# Altium project PRJ_0110_AA.PrjPCB
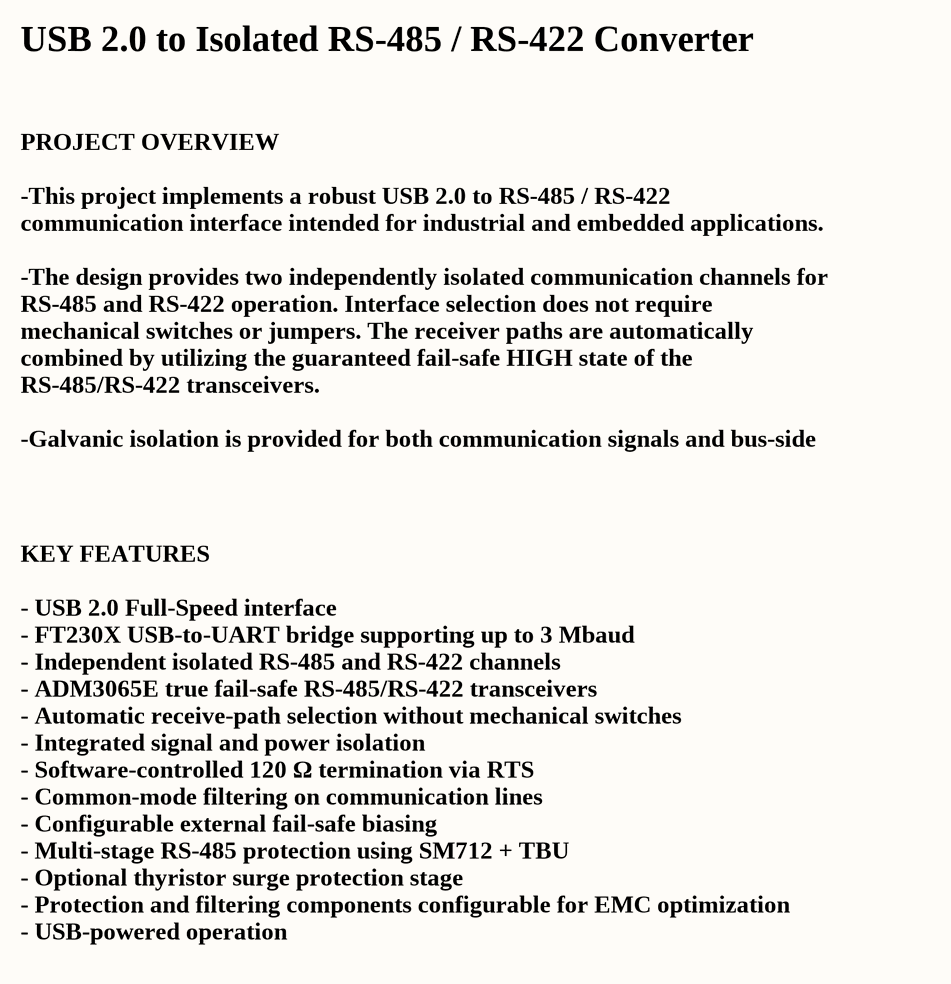
[diagram p0: Header.SchDoc]
pReleaseDate: 09/2026; pProjectName: USB to RS485_RS422 Converter; pProjectCode: PRJ_01101; pPreparedBy: Cemil Kendir; pPBARevision: AA; pPBADescription: USB to RS485_RS422 Converter; pPBACode: 01; pModifiedDate: -; pModifiedBy: -; pDrawnBy: Cemil Kendir; pDocumentNumber: PRJ_01101; pDesignEnvironment: Altium Designer 23.9.2; pDesignedBy: Cemil Kendir; pCheckedBy: Cemre Kendir; pApprovedBy: Suheyla Inal KENDİR; FO_CheckedBy: Gunes Kendir; FO_ApprovedBy: Cemre Kendir; DocumentName: ASSEMBLY DOCUMENT
5 sheets, 107 parts. Net scope: hierarchical (ports join the sheet entries above them; power ports are global).
Board file: PRJ_0110_AAAA.PcbDoc
Sheets:
  Header.SchDoc
  Main.SchDoc
    USB To UART = UsbToUart.SchDoc
    RS485 = RS485.SchDoc
    CH_1 = Isolator.SchDoc
    RS422 = RS485.SchDoc
    CH_2 = Isolator.SchDoc

## Sheet Header.SchDoc
size A4 portrait; DocumentNumber: 1; SheetNumber: 1; SheetTotal: 5

### Notes on the sheet
- USB 2.0 to Isolated RS-485 / RS-422 Converter
- PROJECT OVERVIEW
  -This project implements a robust USB 2.0 to RS-485 / RS-422 communication interface intended for industrial and embedded applications.
  -The design provides two independently isolated communication channels for RS-485 and RS-422 operation. Interface selection does not require mechanical switches or jumpers. The receiver paths are automatically combined by utilizing the guaranteed fail-safe HIGH state of the RS-485/RS-422 transceivers.
  -Galvanic isolation is provided for both communication signals and bus-side power. The RS-485 interface includes software-controlled 120 Ω termination and a configurable multi-stage protection network designed to improve immunity against ESD, surge and other bus transients.
- KEY FEATURES
  - USB 2.0 Full-Speed interface
  - FT230X USB-to-UART bridge supporting up to 3 Mbaud
  - Independent isolated RS-485 and RS-422 channels
  - ADM3065E true fail-safe RS-485/RS-422 transceivers
  - Automatic receive-path selection without mechanical switches
  - Integrated signal and power isolation
  - Software-controlled 120 Ω termination via RTS
  - Common-mode filtering on communication lines
  - Configurable external fail-safe biasing
  - Multi-stage RS-485 protection using SM712 + TBU
  - Optional thyristor surge protection stage
  - Protection and filtering components configurable for EMC optimization
  - USB-powered operation
- Tarih/Date
- Tasa/Desig
- Kont/Check
- Onay/Appr
- Sayfa/Sht
- Form
- Ortam/Env
- A4
- /
- Deg Tarihi/Chng Date
- Deg Onay/Chng Appr
- Rev
- (c) 2022 by SCSG Elektronik A.Ş.
  All rights Reserved. No part of this document may be produced or transmitted in any form or by any means electronic, mechanical, photocopying, recording, or otherwise, without prior written permission of SCSG.

## Sheet Main.SchDoc
size A4; DocumentNumber: 1; SheetNumber: 2; SheetTotal: 5
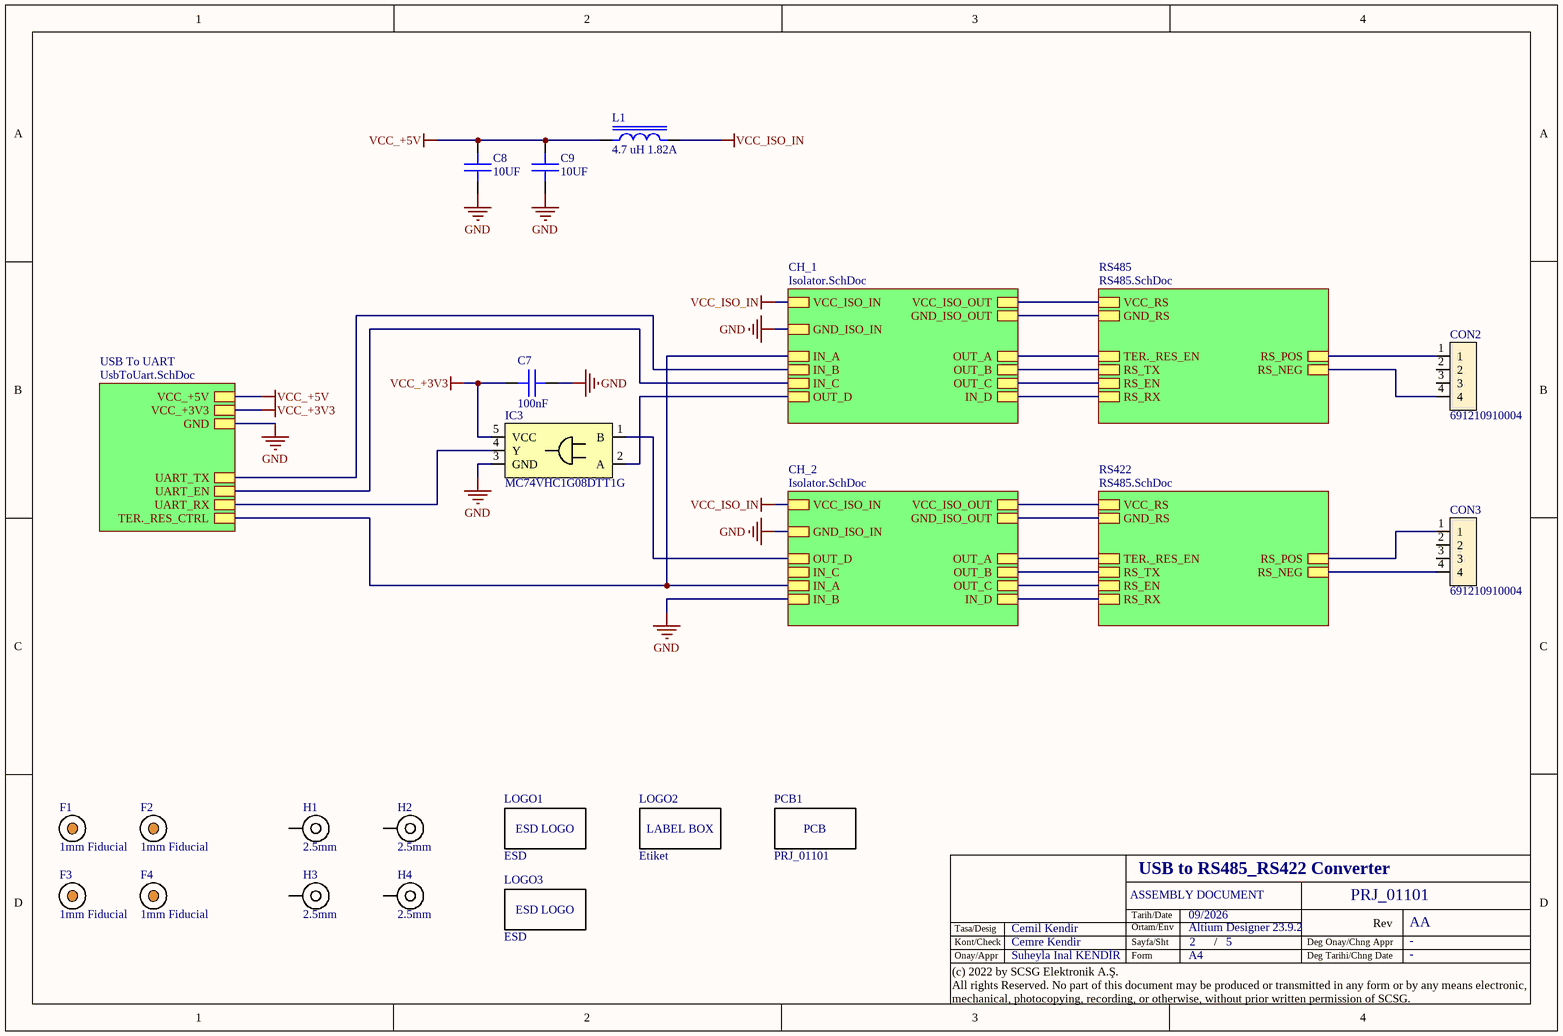
[diagram p1: Main.SchDoc]

### Parts
C7  100nF  [C0603]
C8  10UF  [c1206]
C9  10UF  [c1206]
CON2  691210910004  [691210910004]
CON3  691210910004  [691210910004]
F1  1mm Fiducial  [1mm Fiducial]  (no BOM)
F2  1mm Fiducial  [1mm Fiducial]  (no BOM)
F3  1mm Fiducial  [1mm Fiducial]  (no BOM)
F4  1mm Fiducial  [1mm Fiducial]  (no BOM)
H1  2.5mm  [2.5mm hole]  (no BOM)
H2  2.5mm  [2.5mm hole]  (no BOM)
H3  2.5mm  [2.5mm hole]  (no BOM)
H4  2.5mm  [2.5mm hole]  (no BOM)
IC3  MC74VHC1G08DTT1G  [SOT23-5]
L1  4.7 uH 1.82A  [WE-PD2_4532]
LOGO1  ESD  [ESD]  (no BOM)
LOGO2  Etiket  [ETIKET]  (no BOM)
LOGO3  ESD  [ESD]  (no BOM)
PCB1  PRJ_01101  [PCB]

### Sub-sheets
CH_1 = Isolator.SchDoc: IN_A, IN_B, IN_C, OUT_D, OUT_A, OUT_B, OUT_C, IN_D, VCC_ISO_IN, GND_ISO_IN, VCC_ISO_OUT, GND_ISO_OUT
CH_2 = Isolator.SchDoc: IN_A, IN_B, IN_C, OUT_D, OUT_A, OUT_B, OUT_C, IN_D, VCC_ISO_IN, GND_ISO_IN, VCC_ISO_OUT, GND_ISO_OUT
RS422 = RS485.SchDoc: RS_RX, RS_TX, RS_EN, RS_POS, RS_NEG, GND_RS, VCC_RS, TER._RES_EN
RS485 = RS485.SchDoc: RS_RX, RS_TX, RS_EN, RS_POS, RS_NEG, GND_RS, VCC_RS, TER._RES_EN
USB To UART = UsbToUart.SchDoc: UART_RX, UART_TX, UART_EN, VCC_+3V3, GND, VCC_+5V, TER._RES_CTRL

### Nets
GND: C7.1 C8.1 C9.1 IC3.3(GND) ; sheet USB To UART/GND, sheet CH_1/GND_ISO_IN, sheet CH_2/IN_B, sheet CH_2/GND_ISO_IN
GND_ISO: sheet RS485/GND_RS, sheet CH_1/GND_ISO_OUT, sheet RS422/GND_RS, sheet CH_2/GND_ISO_OUT
VCC_+3V3: C7.2 IC3.5(VCC) ; sheet USB To UART/VCC_+3V3  [project net +3V3]
VCC_+5V: C8.2 C9.2 L1.1 ; sheet USB To UART/VCC_+5V  [project net +5V]
VCC_ISO: sheet RS485/VCC_RS, sheet CH_1/VCC_ISO_OUT, sheet RS422/VCC_RS, sheet CH_2/VCC_ISO_OUT
VCC_ISO_IN: L1.2 ; sheet CH_1/VCC_ISO_IN, sheet CH_2/VCC_ISO_IN  [project net VCC]
___RS485_N: CON2.4 ; sheet RS485/RS_NEG
___RS485_N: CON3.4 ; sheet RS422/RS_NEG  [a separate net that carries the same name]
___RS485_P: CON2.1 ; sheet RS485/RS_POS
___RS485_P: CON3.1 ; sheet RS422/RS_POS  [a separate net that carries the same name]
RS485_EN_ISO: sheet RS485/RS_EN, sheet CH_1/OUT_C
RS485_EN_ISO: sheet RS422/RS_EN, sheet CH_2/OUT_C  [a separate net that carries the same name]
RS485_RX_ISO: sheet RS485/RS_RX, sheet CH_1/IN_D
RS485_RX_ISO: sheet RS422/RS_RX, sheet CH_2/IN_D  [a separate net that carries the same name]
RS485_TX_ISO: sheet RS485/RS_TX, sheet CH_1/OUT_B
RS485_TX_ISO: sheet RS422/RS_TX, sheet CH_2/OUT_B  [a separate net that carries the same name]
TER._RES_CTRL: sheet USB To UART/TER._RES_CTRL, sheet CH_1/IN_A, sheet CH_2/IN_A
UART_EN: sheet USB To UART/UART_EN, sheet CH_1/IN_C
UART_RX: IC3.4(Y) ; sheet USB To UART/UART_RX
UART_TX: sheet USB To UART/UART_TX, sheet CH_1/IN_B
NetIC3_1: IC3.1(B) ; sheet CH_2/OUT_D
NetIC3_2: IC3.2(A) ; sheet CH_1/OUT_D
NetIC4_CH_1_14: sheet RS485/TER._RES_EN, sheet CH_1/OUT_A
NetIC4_CH_2_14: sheet RS422/TER._RES_EN, sheet CH_2/OUT_A

Not connected (* = marked no-connect by the designer): CON2 2 3; CON3 2 3; H1 1; H2 1; H3 1; H4 1

### Notes on the sheet
- Tarih/Date
- Tasa/Desig
- Kont/Check
- Onay/Appr
- Sayfa/Sht
- Form
- Ortam/Env
- A4
- /
- Deg Tarihi/Chng Date
- Deg Onay/Chng Appr
- Rev
- (c) 2022 by SCSG Elektronik A.Ş.
  All rights Reserved. No part of this document may be produced or transmitted in any form or by any means electronic, mechanical, photocopying, recording, or otherwise, without prior written permission of SCSG.
- (in symbol Etiket) LABEL BOX

### Library data of the parts
C7 = CC0603KRX7R8BB104: 100nF, 25V, X7R, 0603; Manufacturer: Yageo; Value: 100000; Tolerance: 10%; Dielectric Material: Ceramic; Purpose Of Usage: BASIC; Working Voltage: 0; Supplier 1: Digi-Key; Supplier Part Number 1: 311-1341-1-ND; Manufacturer Part Number: CC0603KRX7R8BB104; RoHS: YES; Mount: SMD; Case/Package: 0603; Case Code (Imperial): 0603; Case Code (Metric): 1608; Min Operating Temperature: -55°C; Max Operating Temperature: 125°C; Voltage Rating: 25V; Voltage Rating (DC): 25V; Dielectric: X7R; Height: 0.8mm; Category: CAPASITOR; Sub-Category: CERAMIC; Stock ID: ??; Local Supplier: GENERAL; Price 10K: 0.00250
C8 C9 = CL31B106MOHNNNE: 10UF, 16V, X7R, 1206; Manufacturer: Samsung; Value: 10000000; Tolerance: 20%; Dielectric Material: Ceramic; Purpose Of Usage: BASIC; Working Voltage: 0; Supplier 1: Digi-Key; Supplier Part Number 1: 1276-6641-1-ND; Manufacturer Part Number: CL31B106MOHNNNE; RoHS: YES; Mount: SMD; Case/Package: 1206; Case Code (Metric): 3216; Case Code (Imperial): 1206; Min Operating Temperature: -55°C; Max Operating Temperature: 125°C; Dielectric: X7R; Voltage Rating (DC): 16V; Voltage Rating: 16V; Category: CAPASITOR; Sub-Category: CERAMIC; Stock ID: ??; Local Supplier: GENERAL; Price 10K: 0.00250
CON2 CON3 = 691210910004: WR-TBL Terminal block - Rising Cage - THT; Manufacturer: Wurth Elektronik; Current Rating: 6A; Pitch: 2.54mm; Gender: Male; Number of Contacts: 4; Purpose Of Usage: BASIC; Manufacturer Part Number: 691210910004; RoHS: Compliant; Category: CONNECTORS; Length: 10.56mm; Max Operating Temperature: 105°C; Min Operating Temperature: -40°C; Color: Green; Local Supplier: WURTH; Mount: SMD; Stock ID: ??; Sub-Category: TERMINAL BLOCK; Supplier 1: Digi-Key; Supplier Part Number 1: 732-691210910004-ND
F1-F4 = 1mm Fiducial: Manufacturer Part Number: Fiducial 2mm; Purpose Of Usage: BASIC; Category: MECHANICAL; Sub-Category: FIDUCIAL; Manufacturer: --; Mount: NO MOUNT; Stock ID: ??
H1-H4 = 2.5 mm Hole: 2.5mm hole; Purpose Of Usage: BASIC; Category: MECHANICAL; Sub-Category: HOLE; Manufacturer: --; Manufacturer Part Number: --; Mount: NO MOUNT; Stock ID: ??
IC3 = MC74VHC1G08DTT1G: MC74VHC1G08 Series 2 to 5.5 SMT Single 2 Input AND Gate - SOT-23-5; Manufacturer: ON Semiconductor; Max Supply Voltage: 5.5V; Min Supply Voltage: 2V; Purpose Of Usage: BASIC; Manufacturer Part Number: MC74VHC1G08DTT1G; RoHS: YES; Category: INTEGRATED CIRCUITS; Case/Package: SOT-23-5; Min Operating Temperature: -55°C; Max Operating Temperature: 125°C; Package Quantity: 1; Lead Free: Lead Free; Supplier 1: Digi-Key; Supplier Part Number 1: MC74VHC1G08DTT1GOSTR-ND; Mount: SMD; MSL: 1; Stock ID: ??; Sub-Category: LOGIC
L1 = 744773047: WE-PD2, Unshielded Wire-wound SMD Inductor With Ferrite Core, 4.7 Uh, 1.82A I; Manufacturer: Wurth Elektronik; DC Resistance (DCR): 59mΩ; Value: 4.7µH; Inductance Tolerance: 20%; Saturation Current: 2.9A; Self Resonant Frequency: 45MHz; Test Frequency: 10kHz; Manufacturer Part Number: 744773047; RoHS: YES; Category: INDUCTORS; Case/Package: SMD/SMT; Current Rating: 1.82A; Height: 3.2mm; Length: 4mm; Max DC Current: 1.82A; Max Operating Temperature: 125°C; Min Operating Temperature: -40°C; RMS Current (Irms): 1.82A; Shielding: Unshielded; Mount: SMD; Stock ID: ??; Sub-Category: FIXED INDUCTORS; Supplier 1: Digi-Key; Supplier Part Number 1: 732-1252-1-ND
LOGO1 LOGO3 = ESD: ESD LOGO; Purpose Of Usage: BASIC; Category: MECHANICAL; Sub-Category: LOGO; Manufacturer: --; Manufacturer Part Number: ESD; Mount: NO MOUNT; Stock ID: ??
LOGO2 = Etiket: Etiket kutu; Purpose Of Usage: BASIC; Category: MECHANICAL; Sub-Category: LOGO; Manufacturer: --; Manufacturer Part Number: Etiket; Mount: NO MOUNT; Stock ID: ??
PCB1 = PCB: Manufacturer: CUSTOM; Purpose Of Usage: BASIC; Category: MECHANICAL; Local Supplier: CUSTOM; Manufacturer Part Number: CUSTOM; Mount: MECH; Price 10K: 0.25; Stock ID: ??; Sub-Category: PCB; Supplier 1: CUSTOM; Supplier Part Number 1: CUSTOM

## Sheet UsbToUart.SchDoc
size A4 portrait; Address1: 00-<Schema Name>; DocumentNumber: 1; SheetNumber: 3; SheetTotal: 5; ModifiedBy: -; RevisionDate: -; Size: A3
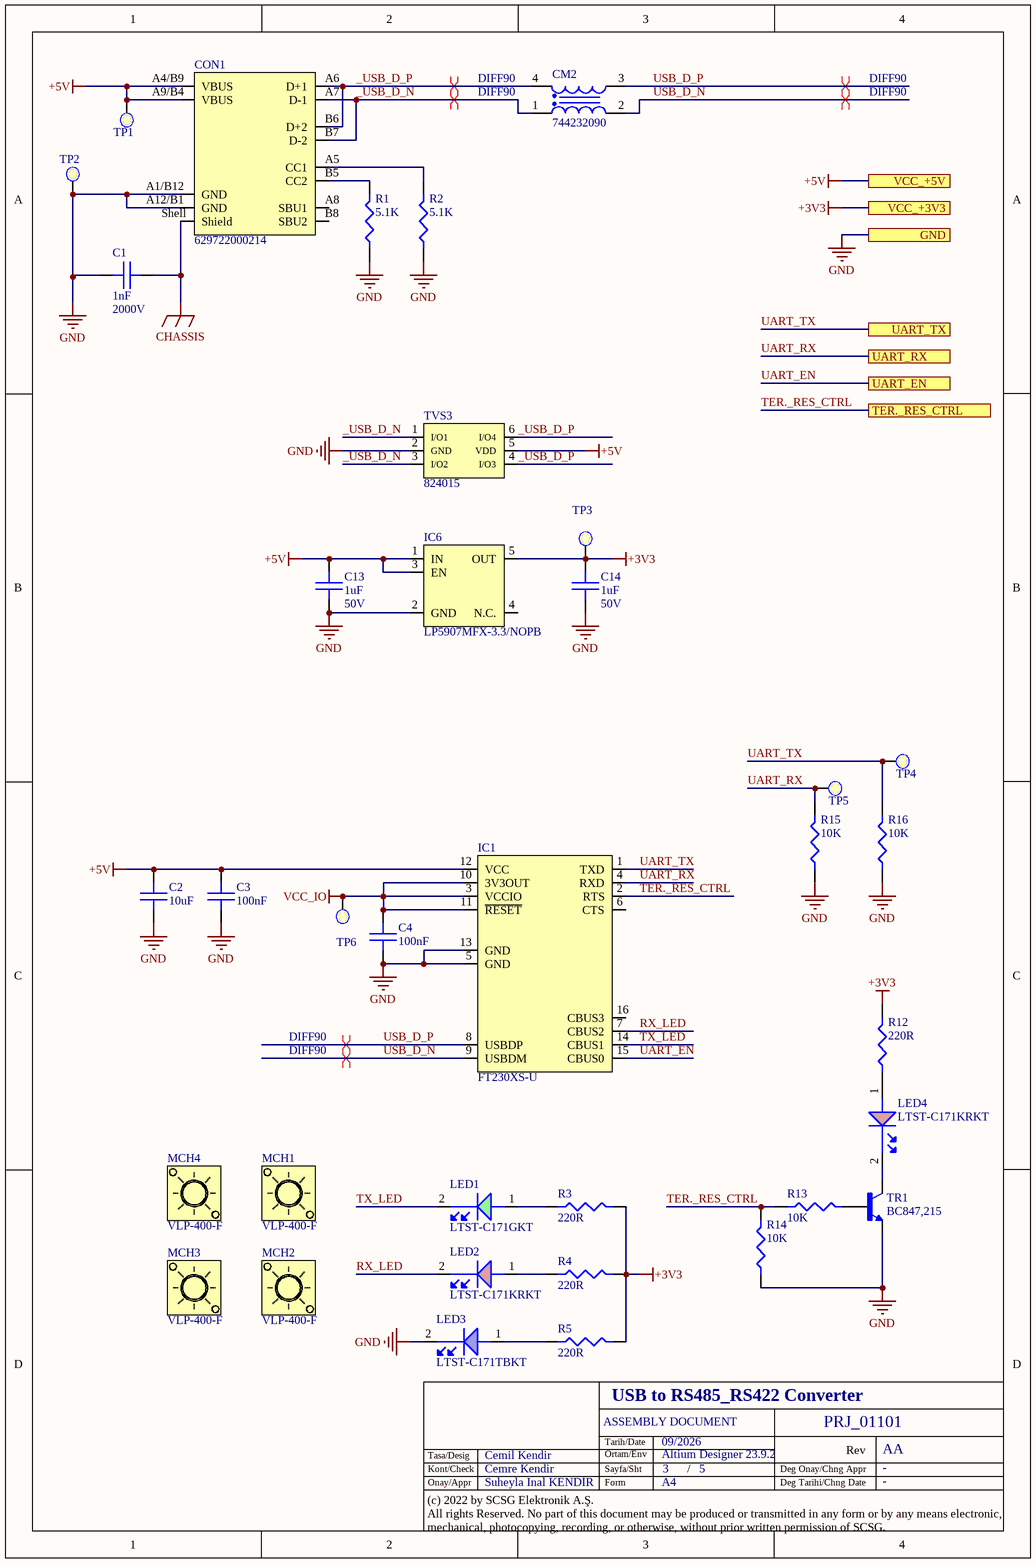
[diagram p2: UsbToUart.SchDoc]

### Parts
C1  1nF  Voltage Rating: 2000V  [C1206]
C2  10uF  [C0805]
C3  100nF  [C0603]
C4  100nF  [C0603]
C13  1uF  Voltage Rating: 50V  [C0603]
C14  1uF  Voltage Rating: 50V  [C0603]
CM2  744232090  [WE-CNSW_1206]
CON1  629722000214  [629722000214]
IC1  FT230XS-U  [SSOP-16]
IC6  LP5907MFX-3.3/NOPB  [SOT23-5]
LED1  LTST-C171GKT  [0805_green]
LED2  LTST-C171KRKT  [0805_RED]
LED3  LTST-C171TBKT  [0805_blue]
LED4  LTST-C171KRKT  [0805_RED]
MCH1  VLP-400-F  [VLP-400-F]
MCH2  VLP-400-F  [VLP-400-F]
MCH3  VLP-400-F  [VLP-400-F]
MCH4  VLP-400-F  [VLP-400-F]
R1  5.1K  [R0402]
R2  5.1K  [R0402]
R3  220R  [R0603]
R4  220R  [R0603]
R5  220R  [R0603]
R12  220R  [R0603]
R13  10K  [R0603]
R14  10K  [R0603]
R15  10K  [R0603]
R16  10K  [R0603]
TP1  TestPoint1  [SMD_1mmPoint]  (value not drawn)  (no BOM)
TP2  TestPoint1  [SMD_1mmPoint]  (value not drawn)  (no BOM)
TP3  TestPoint1  [SMD_1mmPoint]  (value not drawn)  (no BOM)
TP4  TestPoint1  [SMD_1mmPoint]  (value not drawn)  (no BOM)
TP5  TestPoint1  [SMD_1mmPoint]  (value not drawn)  (no BOM)
TP6  TestPoint1  [SMD_1mmPoint]  (value not drawn)  (no BOM)
TR1  BC847,215  [SOT23-3]
TVS3  824015  [SOT-23-6]

### Ports
GND, TER._RES_CTRL, UART_EN, UART_RX, UART_TX, VCC_+3V3, VCC_+5V

### Nets
+3V3: C14.2 IC6.5(OUT) R3.2 R4.2 R5.2 R12.2 TP3.1 ; port VCC_+3V3
+5V: C2.2 C3.2 C13.2 CON1.A4/B9(VBUS) CON1.A9/B4(VBUS) IC1.12(VCC) IC6.1(IN) IC6.3(EN) TP1.1 TVS3.5(VDD) ; port VCC_+5V
CHASSIS: C1.2 CON1.Shell(Shield)
GND: C1.1 C2.1 C3.1 C4.1 C13.1 C14.1 CON1.A1/B12(GND) CON1.A12/B1(GND) IC1.5(GND) IC1.13(GND) IC6.2(GND) LED3.2 R1.1 R2.1 R14.1 R15.1 R16.1 TP2.1 TR1.2(E) TVS3.2(GND) ; port GND
VCC_IO: C4.2 IC1.3(VCCIO) IC1.10(3V3OUT) IC1.11(~{RESET}) TP6.1
_USB_D_N: CM2.1 CON1.A7(D-1) CON1.B7(D-2) TVS3.1(I/O1) TVS3.3(I/O2)
_USB_D_P: CM2.4 CON1.A6(D+1) CON1.B6(D+2) TVS3.4(I/O3) TVS3.6(I/O4)
RX_LED: IC1.7(CBUS2) LED2.2
TER._RES_CTRL: IC1.2(RTS) R13.1 R14.2 ; port TER._RES_CTRL
TX_LED: IC1.14(CBUS1) LED1.2
UART_EN: IC1.15(CBUS0) ; port UART_EN
UART_RX: IC1.4(RXD) R15.2 TP5.1 ; port UART_RX
UART_TX: IC1.1(TXD) R16.2 TP4.1 ; port UART_TX
USB_D_N: CM2.2 IC1.9(USBDM)
USB_D_P: CM2.3 IC1.8(USBDP)
NetCON1_A5: CON1.A5(CC1) R2.2
NetCON1_B5: CON1.B5(CC2) R1.2
NetLED1_1: LED1.1 R3.1
NetLED2_1: LED2.1 R4.1
NetLED3_1: LED3.1 R5.1
NetLED4_1: LED4.1 R12.1
NetLED4_2: LED4.2 TR1.3(C)
NetR13_2: R13.2 TR1.1(B)

Not connected (* = marked no-connect by the designer): CON1 A8(SBU1) B8(SBU2); IC1 6(CTS) 16(CBUS3); IC6 4(N.C.)

### Layout directives
differential pair; net class DIFF90: _USB_D_N, _USB_D_P, USB_D_N, USB_D_P

### Notes on the sheet
- Tarih/Date
- Tasa/Desig
- Kont/Check
- Onay/Appr
- Sayfa/Sht
- Form
- Ortam/Env
- A4
- /
- Deg Tarihi/Chng Date
- Deg Onay/Chng Appr
- Rev
- (c) 2022 by SCSG Elektronik A.Ş.
  All rights Reserved. No part of this document may be produced or transmitted in any form or by any means electronic, mechanical, photocopying, recording, or otherwise, without prior written permission of SCSG.

### Library data of the parts
C1 = CS1206KKX7RDBB102: 1nF, 2kV, X7R, 1206; Manufacturer: Yageo; Dielectric Material: Ceramic; Purpose Of Usage: USB_to_UART; Tolerance: 10%; Value: 1000; Working Voltage: 0; Manufacturer Part Number: CS1206KKX7RDBB102; RoHS: YES; Category: CAPASITOR; Case/Package: 1206; Case Code (Imperial): 1206; Case Code (Metric): 3216; Dielectric: X7R; Height: 1.45mm; Local Supplier: GENERAL; Max Operating Temperature: 125°C; Min Operating Temperature: -55°C; Mount: SMD; Price 10K: 0.5; Stock ID: ??; Sub-Category: CERAMIC; Supplier 1: Digi-Key; Supplier Part Number 1: 13-CS1206KKX7RDBB102TR-ND; Voltage Rating (DC): 2000V
C2 = CC0805KFX7R6BB106: 10uF ,10V ,X7R ,0805; Manufacturer: Yageo; Value: 10000000; Dielectric Material: Ceramic; Tolerance: 10%; Purpose Of Usage: USB_to_UART; Working Voltage: 0; Supplier 1: Digi-Key; Manufacturer Part Number: CC0805KFX7R6BB106; RoHS: YES; Supplier Part Number 1: 13-CC0805KFX7R6BB106CT-ND; Category: CAPASITOR; Sub-Category: CERAMIC; Case/Package: 0805; Case Code (Imperial): 0805; Case Code (Metric): 2012; Dielectric: X7R; Max Operating Temperature: 125°C; Min Operating Temperature: -55°C; Mount: SMD; Stock ID: ??; Voltage Rating (DC): 10V; Voltage Rating: 10V; Local Supplier: GENERAL; Price 10K: 0.00250
C3 C4 = CC0603KRX7R8BB104: 100nF, 25V, X7R, 0603; Manufacturer: Yageo; Value: 100000; Tolerance: 10%; Dielectric Material: Ceramic; Purpose Of Usage: USB_to_UART; Working Voltage: 0; Supplier 1: Digi-Key; Supplier Part Number 1: 311-1341-1-ND; Manufacturer Part Number: CC0603KRX7R8BB104; RoHS: YES; Mount: SMD; Case/Package: 0603; Case Code (Imperial): 0603; Case Code (Metric): 1608; Min Operating Temperature: -55°C; Max Operating Temperature: 125°C; Voltage Rating: 25V; Voltage Rating (DC): 25V; Dielectric: X7R; Height: 0.8mm; Category: CAPASITOR; Sub-Category: CERAMIC; Stock ID: ??; Local Supplier: GENERAL; Price 10K: 0.00250
C13 C14 = CC0603KRX7R9BB105: 1uF, 50V, X7R, 0603; Manufacturer: Yageo; Value: 1000000; Tolerance: 10%; Dielectric Material: Ceramic; Purpose Of Usage: USB_to_UART; Working Voltage: 0; Manufacturer Part Number: CC0603KRX7R9BB105; RoHS: YES; Category: CAPASITOR; Case/Package: 0603; Case Code (Metric): 1608; Case Code (Imperial): 0603; Min Operating Temperature: -55°C; Max Operating Temperature: 125°C; Dielectric: X7R; Voltage Rating (DC): 50V; Height: 0.95mm; Local Supplier: GENERAL; Mount: SMD; MSL: 1; Price 10K: 0.00250; Stock ID: ??; Sub-Category: CERAMIC; Supplier 1: Digi-Key; Supplier Part Number 1: 311-2082-2-ND
CM2 = 744232090: Common Mode Chokes Dual 90Ohm 100MHz 370mA SMD T/R; Manufacturer: Wurth Electronics; Value: 3.3H; DC Resistance (DCR): 300mR; Inductance Tolerance: 25%; Purpose Of Usage: USB_to_UART; Supplier 1: Digi-Key; Supplier Part Number 1: 732-1469-1-ND; Manufacturer Part Number: 744232090; RoHS: YES; Mount: SMD; Case/Package: SMD/SMT; Min Operating Temperature: -40°C; Max Operating Temperature: 125°C; Current Rating: 370mA; Length: 3.2mm; Category: INDUCTORS; Sub-Category: COMMON MODE CHOKES; Stock ID: ??
CON1 = 629722000214: Wr-com_usb 2.0_TYPE C_horizontal; Manufacturer: Wurth Elektronik; Gender: Receptacle; Number of Contacts: 16; Purpose Of Usage: USB_to_UART; Manufacturer Part Number: 629722000214; Category: CONNECTORS; Local Supplier: WURTH; Max Operating Temperature: 85°C; Min Operating Temperature: -40°C; Mount: SMD; Orientation: Right Angle; RoHS: Yes; Stock ID: ??; Sub-Category: USB Type-C; Supplier 1: Digi-Key; Supplier Part Number 1: 732-629722000214TR-ND
IC1 = FT230XS-U: USB Interface IC USB to Basic Serial UART IC SSOP-16; Manufacturer: FTDI; Purpose Of Usage: USB_to_UART; Supplier 1: Digi-Key; Manufacturer Part Number: FT230XS-U; Stock 1: 4799; RoHS: YES; Case/Package: SSOP; Package Quantity: 100; Lead Free: Lead Free; Category: INTEGRATED CIRCUITS; Supplier Part Number 1: 768-1154-5-ND; Sub-Category: USB to UART; Mount: SMD; Stock ID: ??
IC6 = LP5907MFX-3.3/NOPB: Linear Voltage Regulator IC Positive Fixed 1 Output 250mA SOT-23-5; Manufacturer: TEXAS; Purpose Of Usage: USB_to_UART; Topology: LDO; Max Supply Voltage: 5.5V; Min Supply Voltage: 3.6V; Supplier 1: Digi-Key; Manufacturer Part Number: LP5907MFX-3.3/NOPB; Stock 1: 5836; RoHS: YES; Mount: SMD; Case/Package: SOT-23-5; Package Quantity: 3000; Lead Free: Lead Free; Category: INTEGRATED CIRCUITS; Sub-Category: PMIC - LINEAR REGULATOR; Supplier Part Number 1: 296-38557-2-ND; Stock ID: ??; Max Operating Temperature: +125; Min Operating Temperature: -40; MSL: 1
LED1 = LTST-C171GKT: LED GREEN CLEAR CHIP SMD; Manufacturer: Vishay Lite-On; Purpose Of Usage: USB_to_UART; Supplier 1: Digi-Key; Supplier Part Number: 160-1423-1-ND; Manufacturer Part Number: LTST-C171GKT; RoHS: YES; Mount: SMD; Case/Package: 0805; Color: Green; Min Operating Temperature: -55°C; Max Operating Temperature: 85°C; Category: DIODE; Sub-Category: LED; Stock ID: ??; Supplier Part Number 1: 160-1423-1-ND
LED2 LED4 = LTST-C171KRKT: LED RED CLEAR SMD; Manufacturer: Vishay Lite-On; Purpose Of Usage: USB_to_UART; Supplier 1: Digi-Key; Supplier Part Number 1: 160-1427-1-ND; Manufacturer Part Number: LTST-C171KRKT; RoHS: YES; Mount: SMD; Case/Package: 0805; Color: Red; Min Operating Temperature: -55°C; Max Operating Temperature: 85°C; Category: DIODE; Sub-Category: LED; Stock ID: ??
LED3 = LTST-C171TBKT: LED BLUE CLEAR CHIP SMD; Manufacturer: Vishay Lite-On; Purpose Of Usage: USB_to_UART; Supplier 1: Digi-Key; Supplier Part Number 1: 160-1645-1-ND; Manufacturer Part Number: LTST-C171TBKT; RoHS: YES; Mount: SMD; Case/Package: 0805; Color: Blue; Min Operating Temperature: -20°C; Max Operating Temperature: 80°C; Category: DIODE; Sub-Category: LED; Stock ID: ??
MCH1-MCH4 = VLP-400-F: Bivar straight light guide, rigidity, PCBinstall, 4.1 x 4.1 x 10.2mm; Element Configuration: Single; Purpose Of Usage: USB_to_UART; Manufacturer: Bivar; Manufacturer Part Number: VLP-400-F; RoHS: YES; Category: MECHANICAL; Length: 10.16mm; Material: PC, Polycarbonate; Mounting Technology: PCB; Local Supplier: Bivar; Mount: MECH; Stock ID: ??; Sub-Category: LED PIPE; Supplier 1: Digi-Key; Supplier Part Number 1: 492-1516-ND
R1 R2 = RC0402FR-075K1L: 5.1K, %1, 1/16W, 0402; Manufacturer: YAGEO; Max Power Dissipation: 63mW; Power Rating: 62.5mW; Value: 5100; Temperature Coefficient: 100ppm/°C; Tolerance: 1%; Voltage Rating: 50V; Purpose Of Usage: USB_to_UART; Manufacturer Part Number: RC0402FR-075K1L; RoHS: Compliant; Category: RESISTOR; Case/Package: 0402; Case Code (Imperial): 0402; Max Operating Temperature: 155°C; Min Operating Temperature: -55°C; Voltage Rating (DC): 50V; Working Voltage: 50V; Local Supplier: GENERAL; Mount: SMD; Price 10K: 0.0025; Stock ID: ??; Sub-Category: CHIP RESISTOR; Supplier 1: Digi-Key; Supplier Part Number 1: 311-5.10KLRTR-ND
R3-R5 R12 = RC0603FR-07220RL: 220R, %1, 1/10W, 0603; Manufacturer: YAGEO; Value: 220; Tolerance: 1%; Voltage Rating (DC): 50V; Temperature Coefficient: 100ppm/°C; Power Rating: 100mW; Purpose Of Usage: USB_to_UART; Supplier 1: Digi-Key; Supplier Part Number 1: 311-220HRCT-ND; Manufacturer Part Number: RC0603FR-07220RL; RoHS: YES; Case/Package: 0603; Case Code (Imperial): 0603; Min Operating Temperature: -55°C; Max Operating Temperature: 155°C; Voltage Rating: 50V; Max Power Dissipation: 100mW; Category: RESISTOR; Sub-Category: CHIP RESISTOR; Stock ID: ??; Mount: SMD; Price 10K: 0.0025; Local Supplier: GENERAL
R13-R16 = RT0603FRE0710KL: 10K, %1, 1/10W, 0603; Manufacturer: YAGEO; Value: 10000; Tolerance: 1%; Power Rating: 100mW; Voltage Rating: 75V; Temperature Coefficient: 50ppm/°C; Purpose Of Usage: USB_to_UART; Supplier 1: Digi-Key; Supplier Part Number 1: YAG2321CT-ND; Manufacturer Part Number: RT0603FRE0710KL; RoHS: YES; Case/Package: 0603; Case Code (Imperial): 0603; Min Operating Temperature: -55°C; Max Operating Temperature: 125°C; Max Power Dissipation: 100mW; Voltage Rating (DC): 75V; Category: RESISTOR; Supplier 2: JLCPCB; Supplier Part Number 2: C25804; Sub-Category: CHIP RESISTOR; Stock ID: ??; Mount: SMD; Price 10K: 0.0025; Local Supplier: GENERAL
TP1-TP6 = TestPoint1: test ölçüm noktası; Manufacturer: NO BOM DEVICE; Purpose Of Usage: USB_to_UART; Category: CONNECTORS; Sub-Category: TEST POINT; Manufacturer Part Number: NO BOM DEVICE; Stock ID: ??
TR1 = BC847,215: TRANS NPN 45V 0.1A SOT23; Manufacturer: Nexperia; Purpose Of Usage: USB_to_UART; Supplier 1: Digi-Key; Supplier Part Number 1: 1727-4855-1-ND; Manufacturer Part Number: BC847,215; RoHS: NO; Category: TRANSISTOR; Case/Package: SOT-23-3; Max Operating Temperature: 150°C; Min Operating Temperature: -55°C; Mount: SMD; Sub-Category: NPN; Stock ID: ??; Price 10K: 0.021; Local Supplier: OZDISAN
TVS3 = 824015: WURTH ELEKTRONIK - 824015 - TVS Diode, 82401 Series, Bidirectional, 5 V, 13 V, SOT-23, 6 Pins; Manufacturer: Wurth Electronics; Direction: UNI; Clamping Voltage: 7.8V; Purpose Of Usage: USB_to_UART; Supplier 1: Digi-Key; Supplier Part Number 1: 732-4467-1-ND; Manufacturer Part Number: 824015; RoHS: YES; Mount: SMD; Case/Package: SOT-23-6; Min Operating Temperature: -55°C; Max Operating Temperature: 125°C; Category: DIODE; Sub-Category: TVS; Stock ID: ??

## Sheet RS485.SchDoc
size A3; DocumentNumber: 1; SheetNumber: 5; SheetTotal: 5; ModifiedBy: -; RevisionDate: -; Size: A3
Used 2 times, as channels RS485, RS422. Parts and nets are listed once, with the designators drawn on the sheet.
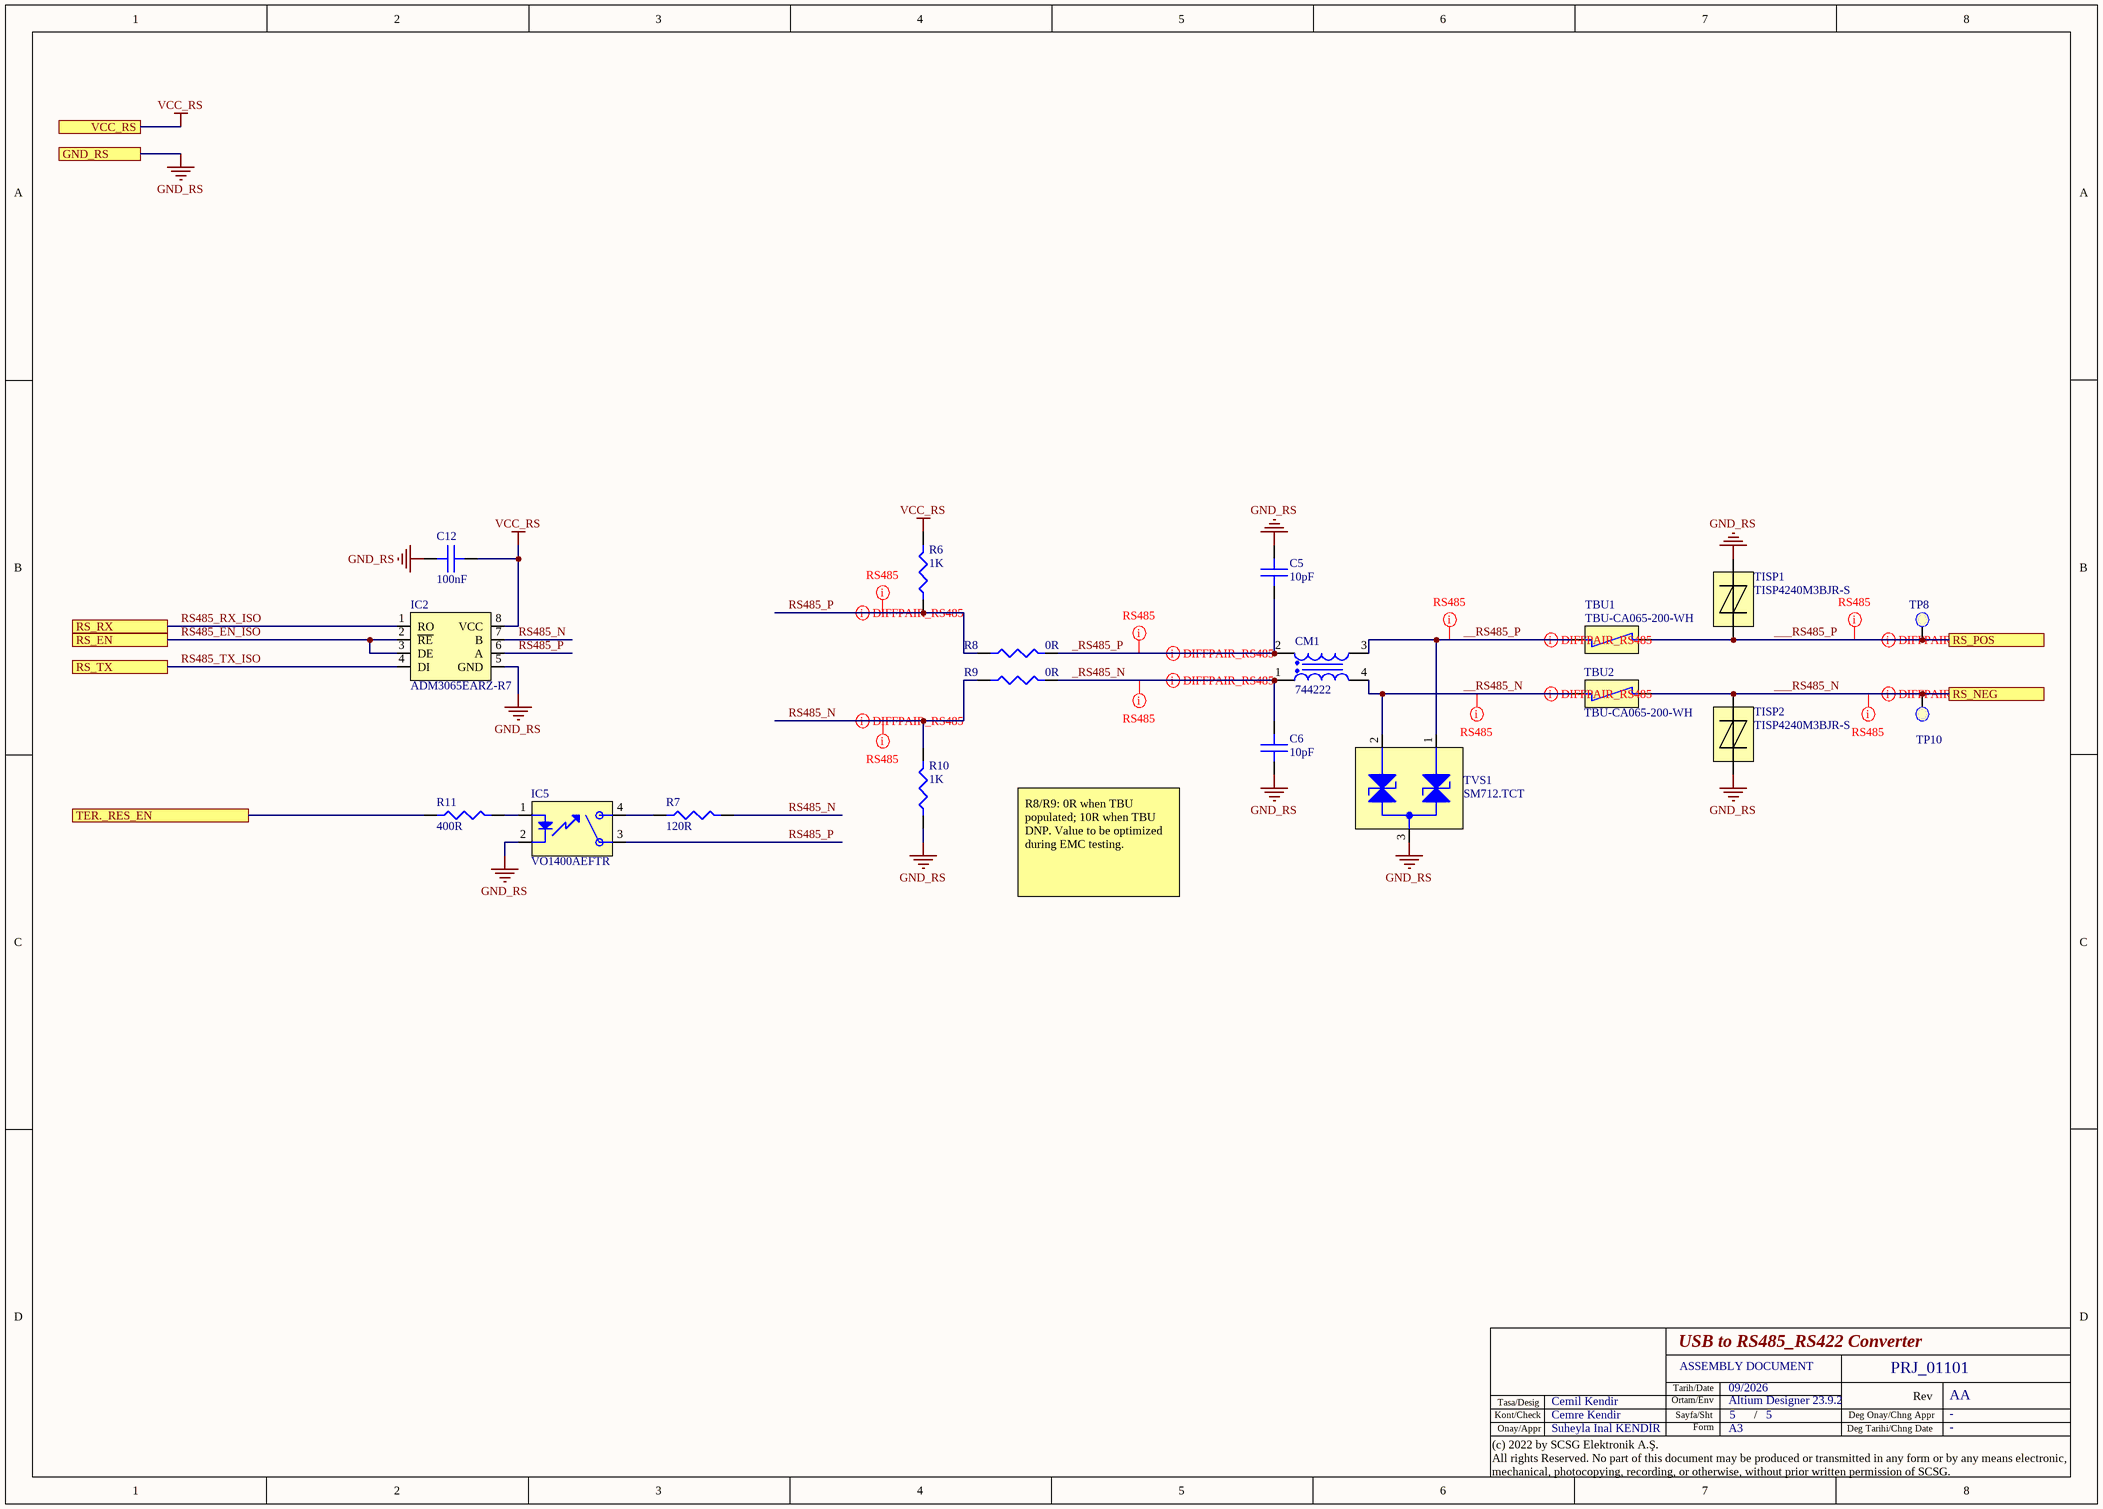
[diagram p3: RS485.SchDoc]

### Parts
C5  10pF  [C0402]
C6  10pF  [C0402]
C12  100nF  [C0603]
CM1  744222  [WE-SL2_74422]
IC2  ADM3065EARZ-R7  [SO08]
IC5  VO1400AEFTR  [SOP-4]
R6  1K  [R0805]
R7  120R  [R0805]
R8  0R  [R0603]
R9  0R  [R0603]
R10  1K  [R0805]
R11  400R  [R0603]
TBU1  TBU-CA065-200-WH  [TBU-CA065-200-WH]
TBU2  TBU-CA065-200-WH  [TBU-CA065-200-WH]
TISP1  TISP4240M3BJR-S  [SMB/DO-214AA]
TISP2  TISP4240M3BJR-S  [SMB/DO-214AA]
TP8  TestPoint1  [SMD_1mmPoint]  (value not drawn)  (no BOM)
TP10  TestPoint1  [SMD_1mmPoint]  (value not drawn)  (no BOM)
TVS1  SM712.TCT  [WE-TVS_SOT23-3L]

### Ports
GND_RS, RS_EN, RS_NEG, RS_POS, RS_RX, RS_TX, TER._RES_EN, VCC_RS

### Nets
GND_RS: C5.2 C6.1 C12.2 IC2.5(GND) IC5.2 R10.1 TISP1.1 TISP2.1 TVS1.3(GND) ; port GND_RS
VCC_RS: C12.1 IC2.8(VCC) R6.2 ; port VCC_RS
___RS485_N: TBU2.2 TISP2.2 TP10.1 ; port RS_NEG
___RS485_P: TBU1.2 TISP1.2 TP8.1 ; port RS_POS
__RS485_N: CM1.4 TBU2.1 TVS1.2(I/O_2)
__RS485_P: CM1.3 TBU1.1 TVS1.1(I/O_1)
_RS485_N: C6.2 CM1.1 R9.2
_RS485_P: C5.1 CM1.2 R8.2
RS485_EN_ISO: IC2.2(~{RE}) IC2.3(DE) ; port RS_EN
RS485_N: IC2.7(B) R7.2 R9.1 R10.2
RS485_P: IC2.6(A) IC5.3 R6.1 R8.1
RS485_RX_ISO: IC2.1(RO) ; port RS_RX
RS485_TX_ISO: IC2.4(DI) ; port RS_TX
TER._RES_EN: R11.1 ; port TER._RES_EN
NetIC5_1: IC5.1 R11.2
NetIC5_4: IC5.4 R7.1

### Channels
RS485: designators end in _RS485; ports GND_RS=GND_ISO RS_EN=RS485_EN_ISO RS_NEG=___RS485_N RS_POS=___RS485_P RS_RX=RS485_RX_ISO RS_TX=RS485_TX_ISO TER._RES_EN=NetIC4_CH_1_14 VCC_RS=VCC_ISO
RS422: designators end in _RS422; ports GND_RS=GND_ISO RS_EN=RS485_EN_ISO RS_NEG=___RS485_N RS_POS=___RS485_P RS_RX=RS485_RX_ISO RS_TX=RS485_TX_ISO TER._RES_EN=NetIC4_CH_2_14 VCC_RS=VCC_ISO

### Layout directives
net class RS485: ___RS485_N, ___RS485_P, __RS485_N_RS485, __RS485_P_RS485, _RS485_N_RS485, _RS485_P_RS485, RS485_N_RS485, RS485_P_RS485
differential pair: ___RS485_N, ___RS485_P, __RS485_N_RS485, __RS485_P_RS485, _RS485_N_RS485, _RS485_P_RS485, RS485_N_RS485, RS485_P_RS485

### Notes on the sheet
- R8/R9: 0R when TBU populated; 10R when TBU DNP. Value to be optimized during EMC testing.
- Tarih/Date
- Kont/Check
- Tasa/Desig
- Onay/Appr
- Ortam/Env
- Sayfa/Sht
- Form
- A3
- /
- Deg Tarihi/Chng Date
- Deg Onay/Chng Appr
- Rev
- (c) 2022 by SCSG Elektronik A.Ş.
  All rights Reserved. No part of this document may be produced or transmitted in any form or by any means electronic, mechanical, photocopying, recording, or otherwise, without prior written permission of SCSG.

### Library data of the parts
C5 C6 = CC0402JRNPO9BN100: 10pF, 50V, NP0, 0402; Manufacturer: Yageo; Dielectric Material: Ceramic; Value: 10; Tolerance: 5%; Dielectric: C0G; Temperature Coefficient: 30ppm/°C; Purpose Of Usage: RS485; Working Voltage: 0; Supplier 1: Digi-Key; Manufacturer Part Number: CC0402JRNPO9BN100; RoHS: YES; Category: CAPASITOR; Case/Package: 0402; Case Code (Metric): 1005; Case Code (Imperial): 0402; Min Operating Temperature: -55°C; Max Operating Temperature: 125°C; Voltage Rating: 50V; Voltage Rating (DC): 50V; Height: 0.5mm; Supplier Part Number 1: 311-1014-2-ND; Mount: SMD; Stock ID: ??; Sub-Category: CERAMIC; Local Supplier: GENERAL; Price 10K: 0.00250
C12 = CC0603KRX7R8BB104: 100nF, 25V, X7R, 0603; Manufacturer: Yageo; Value: 100000; Tolerance: 10%; Dielectric Material: Ceramic; Purpose Of Usage: RS485; Working Voltage: 0; Supplier 1: Digi-Key; Supplier Part Number 1: 311-1341-1-ND; Manufacturer Part Number: CC0603KRX7R8BB104; RoHS: YES; Mount: SMD; Case/Package: 0603; Case Code (Imperial): 0603; Case Code (Metric): 1608; Min Operating Temperature: -55°C; Max Operating Temperature: 125°C; Voltage Rating: 25V; Voltage Rating (DC): 25V; Dielectric: X7R; Height: 0.8mm; Category: CAPASITOR; Sub-Category: CERAMIC; Stock ID: ??; Local Supplier: GENERAL; Price 10K: 0.00250
CM1 = 744222: Common Mode Chokes Dual 1000uH 6kOhm 100kHz 0.8A 0.207Ohm DCR SMD T/R Automotive AEC-Q200; Manufacturer: Wurth Elektronik; Current Rating: 800mA; DC Resistance (DCR): 310mΩ; Impedance: 6kΩ; Value: 1mH; Inductance Tolerance: 50%; Purpose Of Usage: RS485; Shielding: Shielded; Manufacturer Part Number: 744222; RoHS: YES; Category: INDUCTORS; Ambient Temperature Range High: 85°C; Ambient Temperature Range Low: -40°C; Case/Package: SMD/SMT; Height: 5mm; Length: 9.2mm; Max DC Current: 800mA; Max Operating Temperature: 125°C; Min Operating Temperature: -40°C; Test Frequency: 100kHz; Mount: SMD; Stock ID: ??; Sub-Category: COMMON MODE CHOKES; Supplier 1: Digi-Key; Supplier Part Number 1: 732-1485-1-ND
IC2 = ADM3065EARZ-R7: 3.0 V to 5.5 V, ±12 kV IEC ESD Protected, Half Duplex 50 Mbps RS-485 Transceiver; Manufacturer: Analog Devices; Max Supply Voltage: 5.5V; Min Supply Voltage: 3V; Purpose Of Usage: RS485; Manufacturer Part Number: ADM3065EARZ-R7; RoHS: YES; Category: INTEGRATED CIRCUITS; Max Operating Temperature: 85°C; Min Operating Temperature: -40°C; Case/Package: SOIC; Lead Free: Lead Free; Mount: SMD; MSL: 1; Stock ID: ??; Sub-Category: RS485 DRIVER; Supplier 1: Digi-Key; Supplier Part Number 1: 505-ADM3065EARZ-R7TR-ND
IC5 = VO1400AEFTR: 1 FORM A SOLID STATE RELAY Transistor Output SSR, 1-Channel, 3750V Isolation; Manufacturer: Vishay; Max Supply Voltage: 1.4V; Purpose Of Usage: RS485; Manufacturer Part Number: VO1400AEFTR; RoHS: YES; Category: INTEGRATED CIRCUITS; Case/Package: SOP; Lead Free: Lead Free; Max Operating Temperature: 85°C; Min Operating Temperature: -40°C; Mount: SMD; MSL: 1; Stock ID: ??; Sub-Category: SOLID STATE RELAY; Supplier 1: Digi-Key; Supplier Part Number 1: VO1400AEFTR-ND
R6 R10 = RC0805JR-071KL: 1K, %5, 1/8W, 0805; Manufacturer: YAGEO; Value: 1000; Tolerance: 5%; Power Rating: 125mW; Voltage Rating: 150V; Temperature Coefficient: 100ppm/°C; Purpose Of Usage: RS485; Supplier 1: Digi-Key; Supplier Part Number 1: 311-1.0KARCT-ND; Manufacturer Part Number: RC0805JR-071KL; RoHS: YES; Case/Package: 0805; Case Code (Imperial): 0805; Min Operating Temperature: -55°C; Max Operating Temperature: 155°C; Category: RESISTOR; Sub-Category: CHIP RESISTOR; Stock ID: ??; Mount: SMD; Max Power Dissipation: 125mW; Price 10K: 0.0025; Local Supplier: GENERAL
R7 = RC0805JR-07120RL: 120R, %5, 1/8W, 0805; Manufacturer: YAGEO; Value: 120; Power Rating: 125mW; Tolerance: 5%; Voltage Rating: 150V; Temperature Coefficient: 100ppm/°C; Purpose Of Usage: RS485; Supplier 1: Digi-Key; Supplier Part Number 1: 311-120ARCT-ND; Manufacturer Part Number: RC0805JR-07120RL; RoHS: YES; Case/Package: 0805; Case Code (Imperial): 0805; Min Operating Temperature: -55°C; Max Operating Temperature: 155°C; Max Power Dissipation: 125mW; Category: RESISTOR; Sub-Category: CHIP RESISTOR; Stock ID: ??; Mount: SMD; Price 10K: 0.0025; Local Supplier: GENERAL
R8 R9 = RC0603FR-070RL: 0R ,%1 ,1/10 W ,0603; Manufacturer: YAGEO; Value: 0; Power Rating: 100mW; Tolerance: 1%; Voltage Rating: 50V; Temperature Coefficient: 200ppm/°C; Working Voltage: 75V; Purpose Of Usage: RS485; Supplier 1: Digi-Key; Supplier Part Number 1: 311-0.0HRCT-ND; Manufacturer Part Number: RC0603FR-070RL; RoHS: YES; Case/Package: 0603; Case Code (Imperial): 0603; Min Operating Temperature: -55°C; Max Operating Temperature: 155°C; Max Power Dissipation: 100mW; Voltage Rating (DC): 50V; Category: RESISTOR; Supplier 2: JLCPCB; Supplier Part Number 2: C21189; Sub-Category: CHIP RESISTOR; Stock ID: ??; Mount: SMD; Price 10K: 0.0025; Local Supplier: GENERAL
R11 = PAT0603E4000BST1: 400R, %0.1, 1/8W, 0603; Manufacturer: Vishay Dale Thin Film; Max Power Dissipation: 150mW; Purpose Of Usage: RS485; Temperature Coefficient: 25ppm/°C; Tolerance: 0.1%; Value: 400; Manufacturer Part Number: PAT0603E4000BST1; RoHS: YES; Category: RESISTOR; Case/Package: 0603; Case Code (Imperial): 0603; Local Supplier: GENERAL; Max Operating Temperature: 155°C; Min Operating Temperature: -55°C; Mount: SMD; Power Rating: 150mW; Stock ID: ??; Sub-Category: CHIP RESISTOR; Supplier 1: Digi-Key; Supplier Part Number 1: PAT0603E4000BST1
TBU1 TBU2 = TBU-CA065-200-WH: A Single Bi-Directional, 650V, 200mA, 3-Pin DFN pkg TBU | Bourns TBU-CA065-200-WH; Direction: Bidirectional; ESD Protection: Yes; Max Junction Temperature (Tj): 125°C; Number of Circuits: 2; Number of Elements: 1; Peak Pulse Current: 400mA; Value: 8.6Ω; Voltage Rating: 300V; Purpose Of Usage: RS485; Manufacturer: Bourns; Manufacturer Part Number: TBU-CA065-200-WH; RoHS: YES; Category: PROTECTION; Case/Package: DFN; China RoHS: Compliant; Clamping Voltage: 650V; Current Rating: 200mA; Element Configuration: Single; Height: 1mm; Length: 6.5mm; Lifecycle Status: Production; Max Operating Temperature: 125°C; Manufacturer Package Identifier: TBU-CA065-200-WH; Min Operating Temperature: -55°C; Mounting Technology: Surface Mount; Pins: 12; Number of Terminals: 3; Voltage Rating (DC): 650V; Working Voltage: 300V; Local Supplier: GENERAL; Mount: SMD; Stock ID: ??; Sub-Category: TBU; Supplier 1: Digikey; Supplier Part Number 1: TBU-CA065-200-WHTR-ND
TISP1 TISP2 = TISP4240M3BJR-S: TVS Thyristor, Bidirectional, 2 Pins, DO-214AA (SMB), Overvoltage Protector, 240 V, 1 Circuit; Manufacturer: Bourns; Breakdown Voltage: 240V; Value: 50pF; Current Rating: 5A; Forward Voltage: 3V; Hold Current: 350mA; Max Junction Temperature (Tj): 150°C; Number of Circuits: 1; Peak Pulse Current: 220A; Purpose Of Usage: RS485; Manufacturer Part Number: TISP4240M3BJR-S; RoHS: YES; Category: PROTECTION; Case/Package: SMB; China RoHS: Non-Compliant; Export Control Classification Number (ECCN) Code: EAR99; Height: 2.4mm; Harmonized Tariff Schedule (HTS) Code: 8541.30.00.80; Introduction Date: 2005-05-05; Lifecycle Status: Production; Max Operating Temperature: 150°C; Min Operating Temperature: -40°C; Mounting Technology: Surface Mount; Number of Elements: 1; Pins: 2; Number of Terminals: 2; Local Supplier: GENERAL; Mount: SMD; Stock ID: ??; Sub-Category: TISP; Supplier 1: Digikey; Supplier Part Number 1: TISP4240M3BJR-S
TP8 TP10 = TestPoint1: test ölçüm noktası; Manufacturer: NO BOM DEVICE; Purpose Of Usage: RS485; Category: CONNECTORS; Sub-Category: TEST POINT; Manufacturer Part Number: NO BOM DEVICE; Stock ID: ??
TVS1 = SM712.TCT: SM Series 12 V 400 W Asymmetrical TVS Diode for Extended Common-Mode - SOT-23; Manufacturer: Semtech; Direction: Bidirectional; Number of Elements: 2; Min Breakdown Voltage: 7.5V; Clamping Voltage: 26V; Peak Pulse Power: 400W; Leakage Current: 1uA; Peak Pulse Current: 17A; Working Voltage: 12V; Max Breakdown Voltage: 13.3V; ESD Protection: Yes; Max Reverse Leakage Current: 20uA; Number of Channels: 2NUMBER; Purpose Of Usage: RS485; Manufacturer Part Number: SM712.TCT; RoHS: YES; Category: PROTECTION; Mounting Technology: Surface Mount; Case/Package: SOT-23; Pins: 3; Min Operating Temperature: -55°C; Max Operating Temperature: 125°C; Number of Bidirectional Channels: 2; Power Dissipation: 400W; Polarity: Bidirectional; Max Power Dissipation: 400W; Breakdown Voltage: 13.3V; Voltage Rating (DC): 12V; Clamping Voltage-Max: 12V; Length: 2.9mm; Lead Free: Lead Free; Local Supplier: GENERAL; Mount: SMD; Power Rating: 400W; Price 10K: 0.5; Stock ID: ??; Sub-Category: TVS - BI DIRECTIONAL; Supplier 1: Digikey; Supplier Part Number 1: SM712CT-ND

## Sheet Isolator.SchDoc
size A4 portrait; DocumentNumber: 1; SheetNumber: 4; SheetTotal: 5
Used 2 times, as channels CH_1, CH_2. Parts and nets are listed once, with the designators drawn on the sheet.
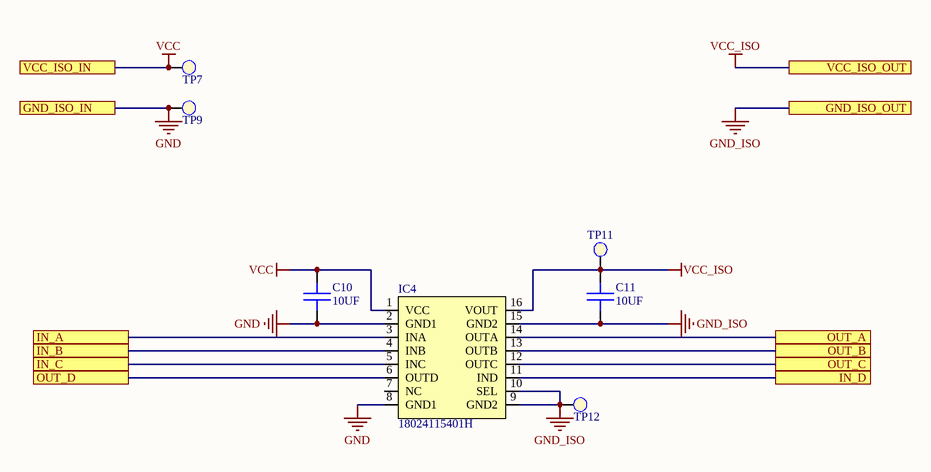
[diagram p4: Isolator.SchDoc]

### Parts
C10  10UF  [c1206]
C11  10UF  [c1206]
IC4  18024115401H  [WPME-CDIP_SOIC-16WB]
TP7  TestPoint1  [SMD_1mmPoint]  (value not drawn)  (no BOM)
TP9  TestPoint1  [SMD_1mmPoint]  (value not drawn)  (no BOM)
TP11  TestPoint1  [SMD_1mmPoint]  (value not drawn)  (no BOM)
TP12  TestPoint1  [SMD_1mmPoint]  (value not drawn)  (no BOM)

### Ports
GND_ISO_IN, GND_ISO_OUT, IN_A, IN_B, IN_C, IN_D, OUT_A, OUT_B, OUT_C, OUT_D, VCC_ISO_IN, VCC_ISO_OUT

### Nets
GND: C10.1 IC4.2(GND1) IC4.8(GND1) TP9.1 ; port GND_ISO_IN
GND_ISO: C11.1 IC4.9(GND2) IC4.10(SEL) IC4.15(GND2) TP12.1 ; port GND_ISO_OUT
VCC: C10.2 IC4.1(VCC) TP7.1 ; port VCC_ISO_IN
VCC_ISO: C11.2 IC4.16(VOUT) TP11.1 ; port VCC_ISO_OUT
IN_A: IC4.3(INA) ; port IN_A
IN_B: IC4.4(INB) ; port IN_B
IN_C: IC4.5(INC) ; port IN_C
IN_D: IC4.11(IND) ; port IN_D
OUT_A: IC4.14(OUTA) ; port OUT_A
OUT_B: IC4.13(OUTB) ; port OUT_B
OUT_C: IC4.12(OUTC) ; port OUT_C
OUT_D: IC4.6(OUTD) ; port OUT_D

Not connected (* = marked no-connect by the designer): IC4 7(NC)

### Channels
CH_1: designators end in _CH_1; ports GND_ISO_IN=GND GND_ISO_OUT=GND_ISO IN_A=TER._RES_CTRL IN_B=UART_TX IN_C=UART_EN IN_D=RS485_RX_ISO OUT_A=NetIC4_CH_1_14 OUT_B=RS485_TX_ISO OUT_C=RS485_EN_ISO OUT_D=NetIC3_2 VCC_ISO_IN=VCC VCC_ISO_OUT=VCC_ISO
CH_2: designators end in _CH_2; ports GND_ISO_IN=GND GND_ISO_OUT=GND_ISO IN_A=TER._RES_CTRL IN_B=GND IN_C=NetIC4_CH_2_5 IN_D=RS485_RX_ISO OUT_A=NetIC4_CH_2_14 OUT_B=RS485_TX_ISO OUT_C=RS485_EN_ISO OUT_D=NetIC3_1 VCC_ISO_IN=VCC VCC_ISO_OUT=VCC_ISO

### Notes on the sheet
- Tarih/Date
- Tasa/Desig
- Kont/Check
- Onay/Appr
- Sayfa/Sht
- Form
- Ortam/Env
- A4
- /
- Deg Tarihi/Chng Date
- Deg Onay/Chng Appr
- Rev
- (c) 2022 by SCSG Elektronik A.Ş.
  All rights Reserved. No part of this document may be produced or transmitted in any form or by any means electronic, mechanical, photocopying, recording, or otherwise, without prior written permission of SCSG.

### Library data of the parts
C10 C11 = CL31B106MOHNNNE: 10UF, 16V, X7R, 1206; Manufacturer: Samsung; Value: 10000000; Tolerance: 20%; Dielectric Material: Ceramic; Purpose Of Usage: ISOLATOR; Working Voltage: 0; Supplier 1: Digi-Key; Supplier Part Number 1: 1276-6641-1-ND; Manufacturer Part Number: CL31B106MOHNNNE; RoHS: YES; Mount: SMD; Case/Package: 1206; Case Code (Metric): 3216; Case Code (Imperial): 1206; Min Operating Temperature: -55°C; Max Operating Temperature: 125°C; Dielectric: X7R; Voltage Rating (DC): 16V; Voltage Rating: 16V; Category: CAPASITOR; Sub-Category: CERAMIC; Stock ID: ??; Local Supplier: GENERAL; Price 10K: 0.00250
IC4 = 18024115401H: WPME-CDIP Capacitive Digital Isolator Powered; Manufacturer: Wurth Elektronik; Manufacturer Part Number: 18024115401H; Category: INTEGRATED CIRCUITS; Max Operating Temperature: 125°C; Min Operating Temperature: -40°C; Case/Package: SOIC-16W; Lead Free: Lead Free; Mount: SMD; MSL: 1; Purpose Of Usage: ISOLATOR; RoHS: YES; Stock ID: ??; Sub-Category: ISOLATOR; Supplier 1: Digi-Key; Supplier Part Number 1: 732-18024115401HTR-ND
TP7 TP9 TP11 TP12 = TestPoint1: test ölçüm noktası; Manufacturer: NO BOM DEVICE; Purpose Of Usage: ISOLATOR; Category: CONNECTORS; Sub-Category: TEST POINT; Manufacturer Part Number: NO BOM DEVICE; Stock ID: ??

## Nets that join several sheets
+3V3: Main (C7.2 IC3.5), UsbToUart (7 pins)
+5V: Main (C8.2 C9.2 L1.1), UsbToUart (10 pins)
GND: Main (C7.1 C8.1 C9.1 IC3.3), UsbToUart (20 pins), CH_1 (C10_CH_1.1 IC4_CH_1.2 IC4_CH_1.8 TP9_CH_1.1), CH_2 (5 pins)
GND_ISO: RS485 (9 pins), CH_1 (5 pins), RS422 (9 pins), CH_2 (5 pins)
VCC: Main (L1.2), CH_1 (C10_CH_1.2 IC4_CH_1.1 TP7_CH_1.1), CH_2 (C10_CH_2.2 IC4_CH_2.1 TP7_CH_2.1)
VCC_ISO: RS485 (C12_RS485.1 IC2_RS485.8 R6_RS485.2), CH_1 (C11_CH_1.2 IC4_CH_1.16 TP11_CH_1.1), RS422 (C12_RS422.1 IC2_RS422.8 R6_RS422.2), CH_2 (C11_CH_2.2 IC4_CH_2.16 TP11_CH_2.1)
___RS485_N: Main (CON2.4), RS485 (TBU2_RS485.2 TISP2_RS485.2 TP10_RS485.1)
___RS485_N: Main (CON3.4), RS422 (TBU2_RS422.2 TISP2_RS422.2 TP10_RS422.1)
___RS485_P: Main (CON2.1), RS485 (TBU1_RS485.2 TISP1_RS485.2 TP8_RS485.1)
___RS485_P: Main (CON3.1), RS422 (TBU1_RS422.2 TISP1_RS422.2 TP8_RS422.1)
NetIC3_1: Main (IC3.1), CH_2 (IC4_CH_2.6)
NetIC3_2: Main (IC3.2), CH_1 (IC4_CH_1.6)
NetIC4_CH_1_14: RS485 (R11_RS485.1), CH_1 (IC4_CH_1.14)
NetIC4_CH_2_14: RS422 (R11_RS422.1), CH_2 (IC4_CH_2.14)
RS485_EN_ISO: RS485 (IC2_RS485.2 IC2_RS485.3), CH_1 (IC4_CH_1.12)
RS485_EN_ISO: RS422 (IC2_RS422.2 IC2_RS422.3), CH_2 (IC4_CH_2.12)
RS485_RX_ISO: RS485 (IC2_RS485.1), CH_1 (IC4_CH_1.11)
RS485_RX_ISO: RS422 (IC2_RS422.1), CH_2 (IC4_CH_2.11)
RS485_TX_ISO: RS485 (IC2_RS485.4), CH_1 (IC4_CH_1.13)
RS485_TX_ISO: RS422 (IC2_RS422.4), CH_2 (IC4_CH_2.13)
TER._RES_CTRL: UsbToUart (IC1.2 R13.1 R14.2), CH_1 (IC4_CH_1.3), CH_2 (IC4_CH_2.3)
UART_EN: UsbToUart (IC1.15), CH_1 (IC4_CH_1.5)
UART_RX: Main (IC3.4), UsbToUart (IC1.4 R15.2 TP5.1)
UART_TX: UsbToUart (IC1.1 R16.2 TP4.1), CH_1 (IC4_CH_1.4)

## Assembly variants
AA: not fitted C5_RS422 C5_RS485 C6_RS422 C6_RS485 R6_RS422 R6_RS485 R10_RS422 R10_RS485 TISP1_RS422 TISP1_RS485 TISP2_RS422 TISP2_RS485